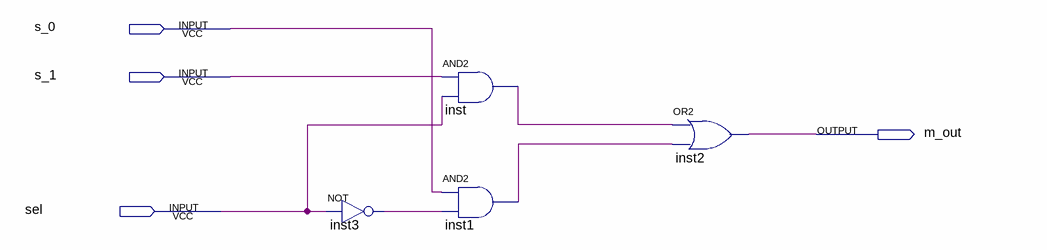
[diagram p0: schematic sheet]
// Quartus schematic mx_2x1.bdf as structural Verilog: 4 symbols, 4 pins
module mx_2x1 (
  input  s_0,
  input  s_1,
  input  sel,
  output m_out
);

  wire inst1_out, inst3_out, inst_out;

  not inst3 (inst3_out, sel);
  and inst (inst_out, s_1, sel);
  and inst1 (inst1_out, s_0, inst3_out);
  or inst2 (m_out, inst_out, inst1_out);
endmodule
